# Altium schematic sheet Mechanical.SchDoc
size A4; SheetNumber: 6; SheetTotal: 6
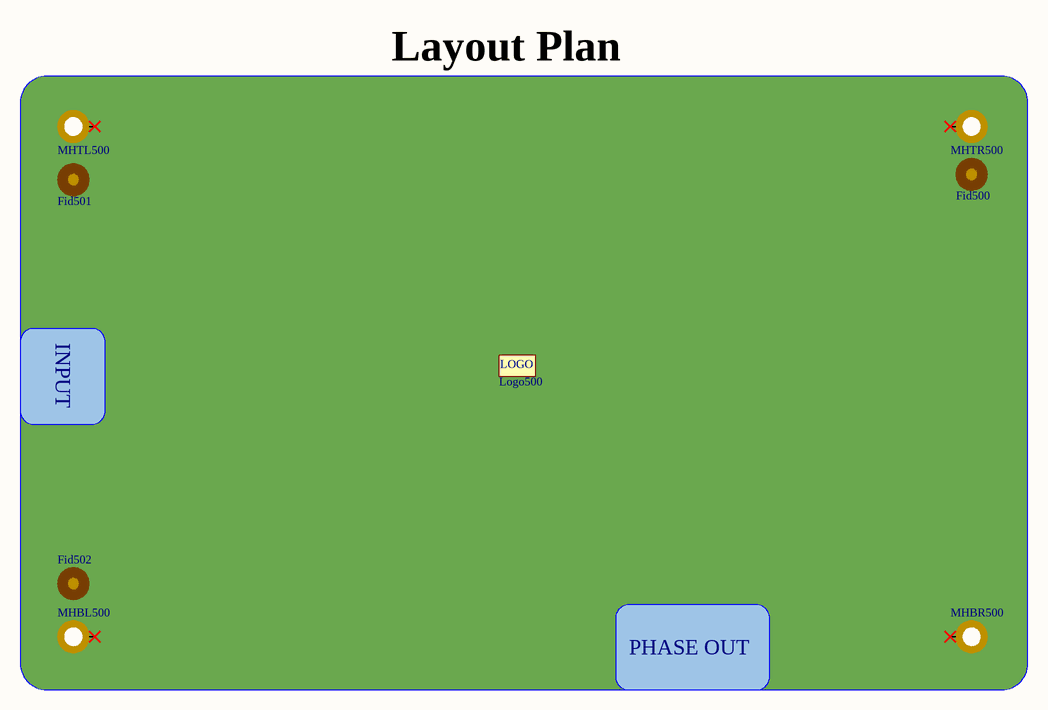
[diagram p0: Mechanical.SchDoc]

## Parts
Fid500  Fiducial  [Fiducial - 2mm, 5mm (SON)]  (value not drawn)  (no BOM)
Fid501  Fiducial  [Fiducial - 2mm, 5mm (SON)]  (value not drawn)  (no BOM)
Fid502  Fiducial  [Fiducial - 2mm, 5mm (SON)]  (value not drawn)  (no BOM)
Logo500  Logo  [Logo 1]  (value not drawn)
MHBL500  Hole  [Mounting Hole - Hole-3.2mm, Pad-5mm]  (value not drawn)  (no BOM)
MHBR500  Hole  [Mounting Hole - Hole-3.2mm, Pad-5mm]  (value not drawn)  (no BOM)
MHTL500  Hole  [Mounting Hole - Hole-3.2mm, Pad-5mm]  (value not drawn)  (no BOM)
MHTR500  Hole  [Mounting Hole - Hole-3.2mm, Pad-5mm]  (value not drawn)  (no BOM)

## Nets

Not connected (* = marked no-connect by the designer): MHBL500 Hole*; MHBR500 Hole*; MHTL500 Hole*; MHTR500 Hole*

## Notes on the sheet
- Layout Plan
- INPUT
- PHASE OUT
- (in symbol Logo) LOGO

## Library data of the parts
Fid500-Fid502 = Fiducial: Component Category: Mechanical; Component Type: Fiducial
Logo500 = Logo: Component Category: Mechanical; Component Type: Logo
MHBL500 MHBR500 MHTL500 MHTR500 = Hole: Mounting Hole; Component Category: Mechanical; Component Type: Mounting Hole